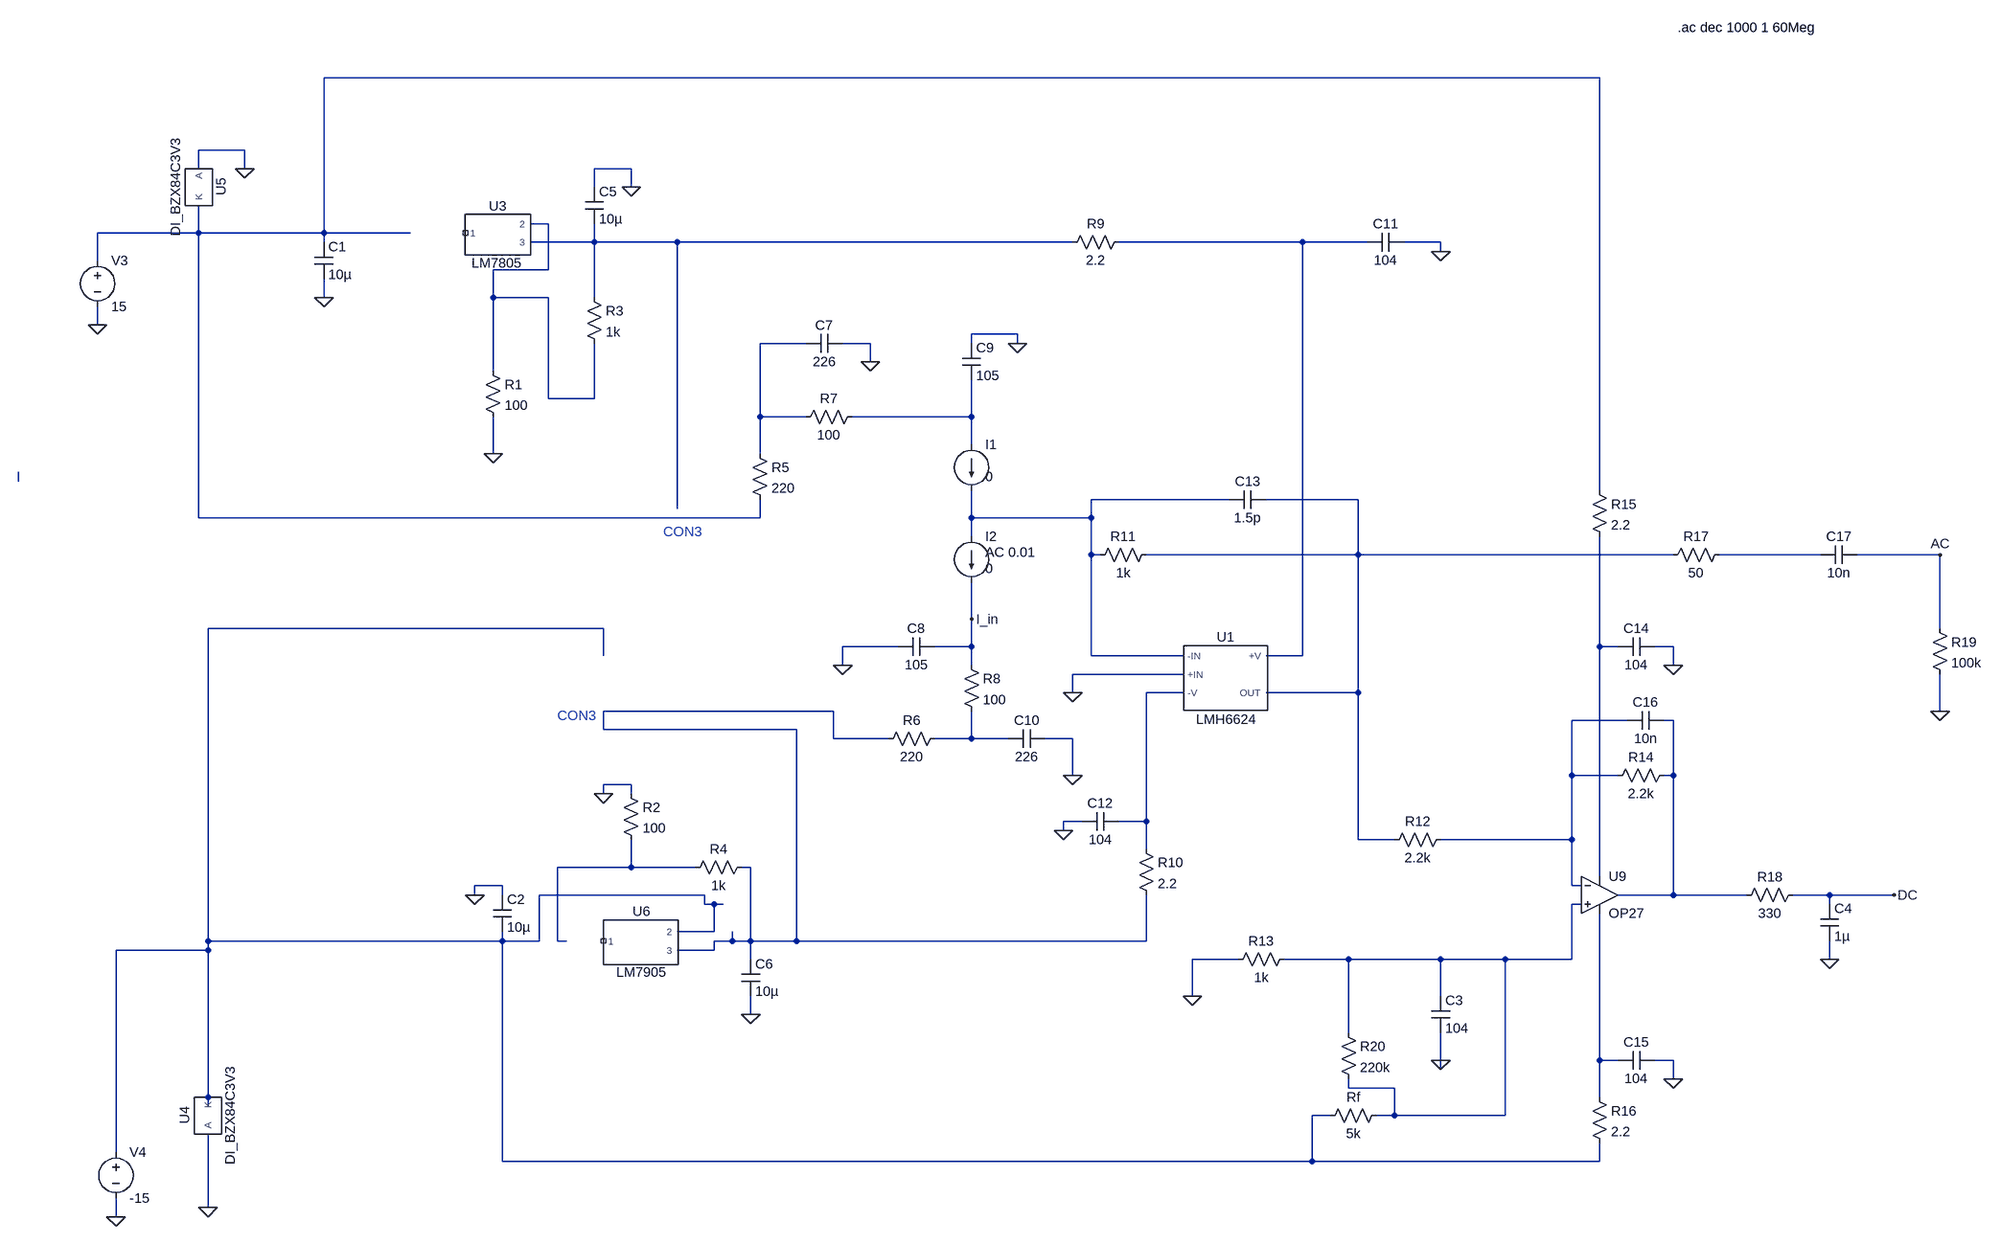
[diagram p0: schematic Photodetector_v2.asc]
Photodetector_v2.asc, the LTspice schematic file:
Version 4.1
SHEET 1 3208 1256
WIRE 2032 -1264 -240 -1264
WIRE -576 -1088 -656 -1088
WIRE -656 -1056 -656 -1088
WIRE -576 -1056 -576 -1088
WIRE 336 -1056 272 -1056
WIRE 272 -1024 272 -1056
WIRE 336 -1024 336 -1056
WIRE 192 -960 160 -960
WIRE -656 -944 -656 -992
WIRE -656 -944 -832 -944
WIRE -240 -944 -240 -1264
WIRE -240 -944 -656 -944
WIRE -48 -944 -240 -944
WIRE -240 -928 -240 -944
WIRE 272 -928 272 -960
WIRE 272 -928 160 -928
WIRE 416 -928 272 -928
WIRE 1104 -928 416 -928
WIRE 1504 -928 1184 -928
WIRE 1616 -928 1504 -928
WIRE 1744 -928 1680 -928
WIRE 1744 -912 1744 -928
WIRE -832 -896 -832 -944
WIRE 192 -880 192 -960
WIRE 192 -880 96 -880
WIRE -240 -832 -240 -864
WIRE 96 -832 96 -880
WIRE 192 -832 96 -832
WIRE 272 -832 272 -928
WIRE -832 -784 -832 -816
WIRE 1008 -768 928 -768
WIRE 640 -752 560 -752
WIRE 752 -752 704 -752
WIRE 928 -752 928 -768
WIRE 1008 -752 1008 -768
WIRE 752 -720 752 -752
WIRE 96 -704 96 -832
WIRE 192 -656 192 -832
WIRE 272 -656 272 -752
WIRE 272 -656 192 -656
WIRE 560 -624 560 -752
WIRE 640 -624 560 -624
WIRE 928 -624 928 -688
WIRE 928 -624 720 -624
WIRE 928 -576 928 -624
WIRE 96 -560 96 -624
WIRE 560 -560 560 -624
WIRE -1328 -512 -1328 -528
WIRE 2032 -496 2032 -1264
WIRE 1376 -480 1136 -480
WIRE 1600 -480 1440 -480
WIRE 416 -464 416 -928
WIRE -656 -448 -656 -944
WIRE 560 -448 560 -480
WIRE 560 -448 -656 -448
WIRE 928 -448 928 -496
WIRE 1136 -448 1136 -480
WIRE 1136 -448 928 -448
WIRE 928 -416 928 -448
WIRE 1136 -384 1136 -448
WIRE 1152 -384 1136 -384
WIRE 1600 -384 1600 -480
WIRE 1600 -384 1232 -384
WIRE 2160 -384 1600 -384
WIRE 2416 -384 2240 -384
WIRE 2624 -384 2480 -384
WIRE 928 -272 928 -336
WIRE 288 -256 -640 -256
WIRE 2624 -256 2624 -384
WIRE 800 -224 704 -224
WIRE 928 -224 928 -272
WIRE 928 -224 864 -224
WIRE 2032 -224 2032 -416
WIRE 2064 -224 2032 -224
WIRE 2160 -224 2128 -224
WIRE 288 -208 288 -256
WIRE 1136 -208 1136 -384
WIRE 1296 -208 1136 -208
WIRE 1504 -208 1504 -928
WIRE 1504 -208 1440 -208
WIRE 704 -192 704 -224
WIRE 928 -192 928 -224
WIRE 2160 -192 2160 -224
WIRE 1296 -176 1104 -176
WIRE 1104 -144 1104 -176
WIRE 1296 -144 1232 -144
WIRE 1600 -144 1600 -384
WIRE 1600 -144 1440 -144
WIRE 688 -112 288 -112
WIRE 2624 -112 2624 -176
WIRE 2080 -96 1984 -96
WIRE 2160 -96 2144 -96
WIRE 288 -80 288 -112
WIRE 624 -80 288 -80
WIRE 688 -64 688 -112
WIRE 784 -64 688 -64
WIRE 928 -64 928 -112
WIRE 928 -64 864 -64
WIRE 992 -64 928 -64
WIRE 1104 -64 1056 -64
WIRE 1104 0 1104 -64
WIRE 1984 0 1984 -96
WIRE 2064 0 1984 0
WIRE 2160 0 2160 -96
WIRE 2160 0 2144 0
WIRE 336 16 288 16
WIRE 288 32 288 16
WIRE 336 32 336 16
WIRE 1120 80 1088 80
WIRE 1232 80 1232 -144
WIRE 1232 80 1184 80
WIRE 1088 96 1088 80
WIRE 1600 112 1600 -144
WIRE 1664 112 1600 112
WIRE 1984 112 1984 0
WIRE 1984 112 1744 112
WIRE 1232 128 1232 80
WIRE 336 160 336 112
WIRE 336 160 208 160
WIRE 448 160 336 160
WIRE 544 160 528 160
WIRE 2032 176 2032 -224
WIRE 112 192 64 192
WIRE 1984 192 1984 112
WIRE 2000 192 1984 192
WIRE 64 208 64 192
WIRE 112 208 112 192
WIRE 464 208 176 208
WIRE 2160 208 2160 0
WIRE 2160 208 2064 208
WIRE 2288 208 2160 208
WIRE 2432 208 2368 208
WIRE 2544 208 2432 208
WIRE 464 224 464 208
WIRE 480 224 464 224
WIRE 496 224 480 224
WIRE 2000 224 1984 224
WIRE 2432 224 2432 208
WIRE 480 272 480 224
WIRE 480 272 416 272
WIRE -640 288 -640 -256
WIRE 112 288 112 272
WIRE 112 288 -640 288
WIRE 176 288 176 208
WIRE 176 288 112 288
WIRE 208 288 208 160
WIRE 224 288 208 288
WIRE 512 288 512 272
WIRE 512 288 480 288
WIRE 544 288 544 160
WIRE 544 288 512 288
WIRE 624 288 624 -80
WIRE 624 288 544 288
WIRE 1232 288 1232 208
WIRE 1232 288 624 288
WIRE -640 304 -640 288
WIRE -640 304 -800 304
WIRE 480 304 480 288
WIRE 480 304 416 304
WIRE 544 320 544 288
WIRE 1392 320 1312 320
WIRE 1584 320 1472 320
WIRE 1744 320 1584 320
WIRE 1856 320 1744 320
WIRE 1984 320 1984 224
WIRE 1984 320 1856 320
WIRE 2432 320 2432 288
WIRE 1312 384 1312 320
WIRE 1744 384 1744 320
WIRE 544 416 544 384
WIRE 1584 448 1584 320
WIRE 1744 496 1744 448
WIRE 2032 496 2032 240
WIRE 2064 496 2032 496
WIRE 2160 496 2128 496
WIRE 1744 512 1744 496
WIRE 2160 528 2160 496
WIRE 1584 544 1584 528
WIRE 1664 544 1584 544
WIRE -640 560 -640 304
WIRE 2032 560 2032 496
WIRE -640 576 -640 560
WIRE 1552 592 1520 592
WIRE 1664 592 1664 544
WIRE 1664 592 1632 592
WIRE 1856 592 1856 320
WIRE 1856 592 1664 592
WIRE -800 656 -800 304
WIRE 112 672 112 288
WIRE 1520 672 1520 592
WIRE 1520 672 112 672
WIRE 2032 672 2032 640
WIRE 2032 672 1520 672
WIRE -640 752 -640 624
WIRE -800 768 -800 736
FLAG 1104 0 0
FLAG 704 -192 0
FLAG 1104 -144 0
FLAG 2160 528 0
FLAG 2160 -192 0
FLAG 2624 -112 0
FLAG -240 -832 0
FLAG 96 -560 0
FLAG 752 -720 0
FLAG 1744 496 0
FLAG 1312 384 0
FLAG 544 416 0
FLAG 64 208 0
FLAG 288 32 0
FLAG 1088 96 0
FLAG 336 -1024 0
FLAG 1744 -912 0
FLAG 1008 -752 0
FLAG 2624 -384 AC
FLAG 2544 208 DC
FLAG -640 752 0
FLAG -576 -1056 0
FLAG -832 -784 0
FLAG -800 768 0
FLAG 928 -272 I_in
FLAG 2432 320 0
DATAFLAG 1136 -176 ""
DATAFLAG 1120 80 ""
DATAFLAG 176 288 ""
DATAFLAG 2336 -384 ""
DATAFLAG 2112 -384 ""
SYMBOL res 80 -720 R0
SYMATTR InstName R1
SYMATTR Value 100
SYMBOL res 320 16 R0
SYMATTR InstName R2
SYMATTR Value 100
SYMBOL res 256 -848 R0
SYMATTR InstName R3
SYMATTR Value 1k
SYMBOL res 544 144 R90
WINDOW 0 0 56 VBottom 2
WINDOW 3 32 56 VTop 2
SYMATTR InstName R4
SYMATTR Value 1k
SYMBOL res 544 -576 R0
SYMATTR InstName R5
SYMATTR Value 220
SYMBOL res 880 -80 R90
WINDOW 0 0 56 VBottom 2
WINDOW 3 32 56 VTop 2
SYMATTR InstName R6
SYMATTR Value 220
SYMBOL res 736 -640 R90
WINDOW 0 0 56 VBottom 2
WINDOW 3 32 56 VTop 2
SYMATTR InstName R7
SYMATTR Value 100
SYMBOL res 912 -208 R0
SYMATTR InstName R8
SYMATTR Value 100
SYMBOL res 1200 -944 R90
WINDOW 0 0 56 VBottom 2
WINDOW 3 32 56 VTop 2
SYMATTR InstName R9
SYMATTR Value 2.2
SYMBOL res 1216 112 R0
SYMATTR InstName R10
SYMATTR Value 2.2
SYMBOL res 1248 -400 R90
WINDOW 0 0 56 VBottom 2
WINDOW 3 32 56 VTop 2
SYMATTR InstName R11
SYMATTR Value 1k
SYMBOL res 1760 96 R90
WINDOW 0 0 56 VBottom 2
WINDOW 3 32 56 VTop 2
SYMATTR InstName R12
SYMATTR Value 2.2k
SYMBOL res 1488 304 R90
WINDOW 0 0 56 VBottom 2
WINDOW 3 32 56 VTop 2
SYMATTR InstName R13
SYMATTR Value 1k
SYMBOL res 2160 -16 R90
WINDOW 0 0 56 VBottom 2
WINDOW 3 32 56 VTop 2
SYMATTR InstName R14
SYMATTR Value 2.2k
SYMBOL res 2016 -512 R0
SYMATTR InstName R15
SYMATTR Value 2.2
SYMBOL res 2016 544 R0
SYMATTR InstName R16
SYMATTR Value 2.2
SYMBOL res 2256 -400 R90
WINDOW 0 0 56 VBottom 2
WINDOW 3 32 56 VTop 2
SYMATTR InstName R17
SYMATTR Value 50
SYMBOL res 2384 192 R90
WINDOW 0 0 56 VBottom 2
WINDOW 3 32 56 VTop 2
SYMATTR InstName R18
SYMATTR Value 330
SYMBOL res 2608 -272 R0
SYMATTR InstName R19
SYMATTR Value 100k
SYMBOL res 1568 432 R0
SYMATTR InstName R20
SYMATTR Value 220k
SYMBOL cap -256 -928 R0
SYMATTR InstName C1
SYMATTR Value 10µ
SYMBOL cap 96 208 R0
SYMATTR InstName C2
SYMATTR Value 10µ
SYMBOL cap 2416 224 R0
SYMATTR InstName C4
SYMATTR Value 1µ
SYMBOL cap 256 -1024 R0
SYMATTR InstName C5
SYMATTR Value 10µ
SYMBOL cap 528 320 R0
SYMATTR InstName C6
SYMATTR Value 10µ
SYMBOL cap 704 -768 R90
WINDOW 0 0 32 VBottom 2
WINDOW 3 32 32 VTop 2
SYMATTR InstName C7
SYMATTR Value 226
SYMBOL cap 864 -240 R90
WINDOW 0 0 32 VBottom 2
WINDOW 3 32 32 VTop 2
SYMATTR InstName C8
SYMATTR Value 105
SYMBOL cap 912 -752 R0
SYMATTR InstName C9
SYMATTR Value 105
SYMBOL cap 1056 -80 R90
WINDOW 0 0 32 VBottom 2
WINDOW 3 32 32 VTop 2
SYMATTR InstName C10
SYMATTR Value 226
SYMBOL cap 1680 -944 R90
WINDOW 0 0 32 VBottom 2
WINDOW 3 32 32 VTop 2
SYMATTR InstName C11
SYMATTR Value 104
SYMBOL cap 1184 64 R90
WINDOW 0 0 32 VBottom 2
WINDOW 3 32 32 VTop 2
SYMATTR InstName C12
SYMATTR Value 104
SYMBOL cap 1440 -496 R90
WINDOW 0 0 32 VBottom 2
WINDOW 3 32 32 VTop 2
SYMATTR InstName C13
SYMATTR Value 1.5p
SYMBOL cap 2128 -240 R90
WINDOW 0 0 32 VBottom 2
WINDOW 3 32 32 VTop 2
SYMATTR InstName C14
SYMATTR Value 104
SYMBOL cap 2128 480 R90
WINDOW 0 0 32 VBottom 2
WINDOW 3 32 32 VTop 2
SYMATTR InstName C15
SYMATTR Value 104
SYMBOL cap 2144 -112 R90
WINDOW 0 0 32 VBottom 2
WINDOW 3 32 32 VTop 2
SYMATTR InstName C16
SYMATTR Value 10n
SYMBOL cap 2480 -400 R90
WINDOW 0 0 32 VBottom 2
WINDOW 3 32 32 VTop 2
SYMATTR InstName C17
SYMATTR Value 10n
SYMBOL cap 1728 384 R0
SYMATTR InstName C3
SYMATTR Value 104
SYMBOL LMH6624 1408 -176 R0
SYMATTR InstName U1
SYMBOL DI_BZX84C3V3 -640 592 R270
SYMATTR InstName U4
SYMBOL DI_BZX84C3V3 -656 -1024 R90
SYMATTR InstName U5
SYMBOL current 928 -576 R0
WINDOW 123 24 28 Left 2
WINDOW 39 0 0 Left 0
WINDOW 3 24 56 Left 2
SYMATTR Value 0
SYMATTR InstName I1
SYMBOL current 928 -416 R0
WINDOW 123 24 28 Left 2
WINDOW 39 0 0 Left 0
WINDOW 3 24 56 Left 2
SYMATTR Value2 AC 0.01
SYMATTR Value 0
SYMATTR InstName I2
SYMBOL OpAmps\\OP27 2032 144 R0
SYMATTR InstName U9
SYMBOL LM7805 112 -944 R0
WINDOW 0 -8 -31 Bottom 2
WINDOW 3 -9 37 Top 2
SYMATTR InstName U3
SYMBOL LM7905 416 288 R0
WINDOW 0 -62 -36 Bottom 2
WINDOW 3 -62 39 Top 2
SYMATTR InstName U6
SYMBOL voltage -832 -912 R0
WINDOW 123 24 44 Left 2
WINDOW 39 0 0 Left 0
SYMATTR InstName V3
SYMATTR Value 15
SYMBOL voltage -800 640 R0
WINDOW 123 24 124 Left 2
WINDOW 39 0 0 Left 0
SYMATTR InstName V4
SYMATTR Value -15
SYMBOL res 1648 576 R90
WINDOW 0 0 56 VBottom 2
WINDOW 3 32 56 VTop 2
SYMATTR InstName Rf
SYMATTR Value 5k
TEXT 208 -104 Left 2 ;CON3
TEXT 392 -424 Left 2 ;CON3
TEXT 2168 -1352 Left 2 !.ac dec 1000 1 60Meg

The netlist it stands for:
* Photodetector_v2.asc
R1 N002 0 100
R2 0 N018 100
R3 N003 N002 1k
R4 N014 N018 1k
R5 N005 N001 220
R6 N017 N014 220
R7 N006 N005 100
R8 I_in N017 100
R9 N004 N003 2.2
R10 N013 N014 2.2
R11 N009 N008 1k
R12 N015 N009 2.2k
R13 N019 0 1k
R14 N016 N015 2.2k
R15 N001 N012 2.2
R16 N020 N011 2.2
R17 N010 N009 50
R18 DC N016 330
R19 AC 0 100k
R20 N019 N019 220k
C1 N001 0 10µ
C2 0 N011 10µ
C4 DC 0 1µ
C5 0 N003 10µ
C6 N014 0 10µ
C7 0 N005 226
C8 I_in 0 105
C9 0 N006 105
C10 0 N017 226
C11 0 N004 104
C12 N013 0 104
C13 N009 N008 1.5p
C14 0 N012 104
C15 0 N020 104
C16 N016 N015 10n
C17 AC N010 10n
C3 N019 0 104
X§U1 0 N008 N004 N013 N009 LMH6624  ; pins +IN -IN +V -V OUT
X§U4 0 N011 DI_BZX84C3V3  ; pins A K
X§U5 0 N001 DI_BZX84C3V3  ; pins A K
I1 N006 N008 0
I2 N008 I_in 0 AC 0.01
X§U9 N019 N015 N012 N020 N016 OP27  ; pins In+ In- V+ V- OUT
X§U3 NC_01 N002 N003 LM7805  ; pins 1 2 3
X§U6 NC_02 N011 N014 LM7905  ; pins 1 2 3
V3 N001 0 15
V4 N011 0 -15
Rf N019 N011 5k
* CON3
* CON3
.ac dec 1000 1 60Meg
.lib C:\Users\ruhiy\projects\photodetector\snom130\LMH6624\LMH6624.MOD
.lib C:\Users\ruhiy\Downloads\BZX84C3V3.spice.txt
.lib ADI.lib
.lib C:\Users\ruhiy\projects\photodetector\regulators.lib.txt
.backanno
.end